# EAGLE schematic Esquemático_Grupo_6 (EAGLE 9.6.2)
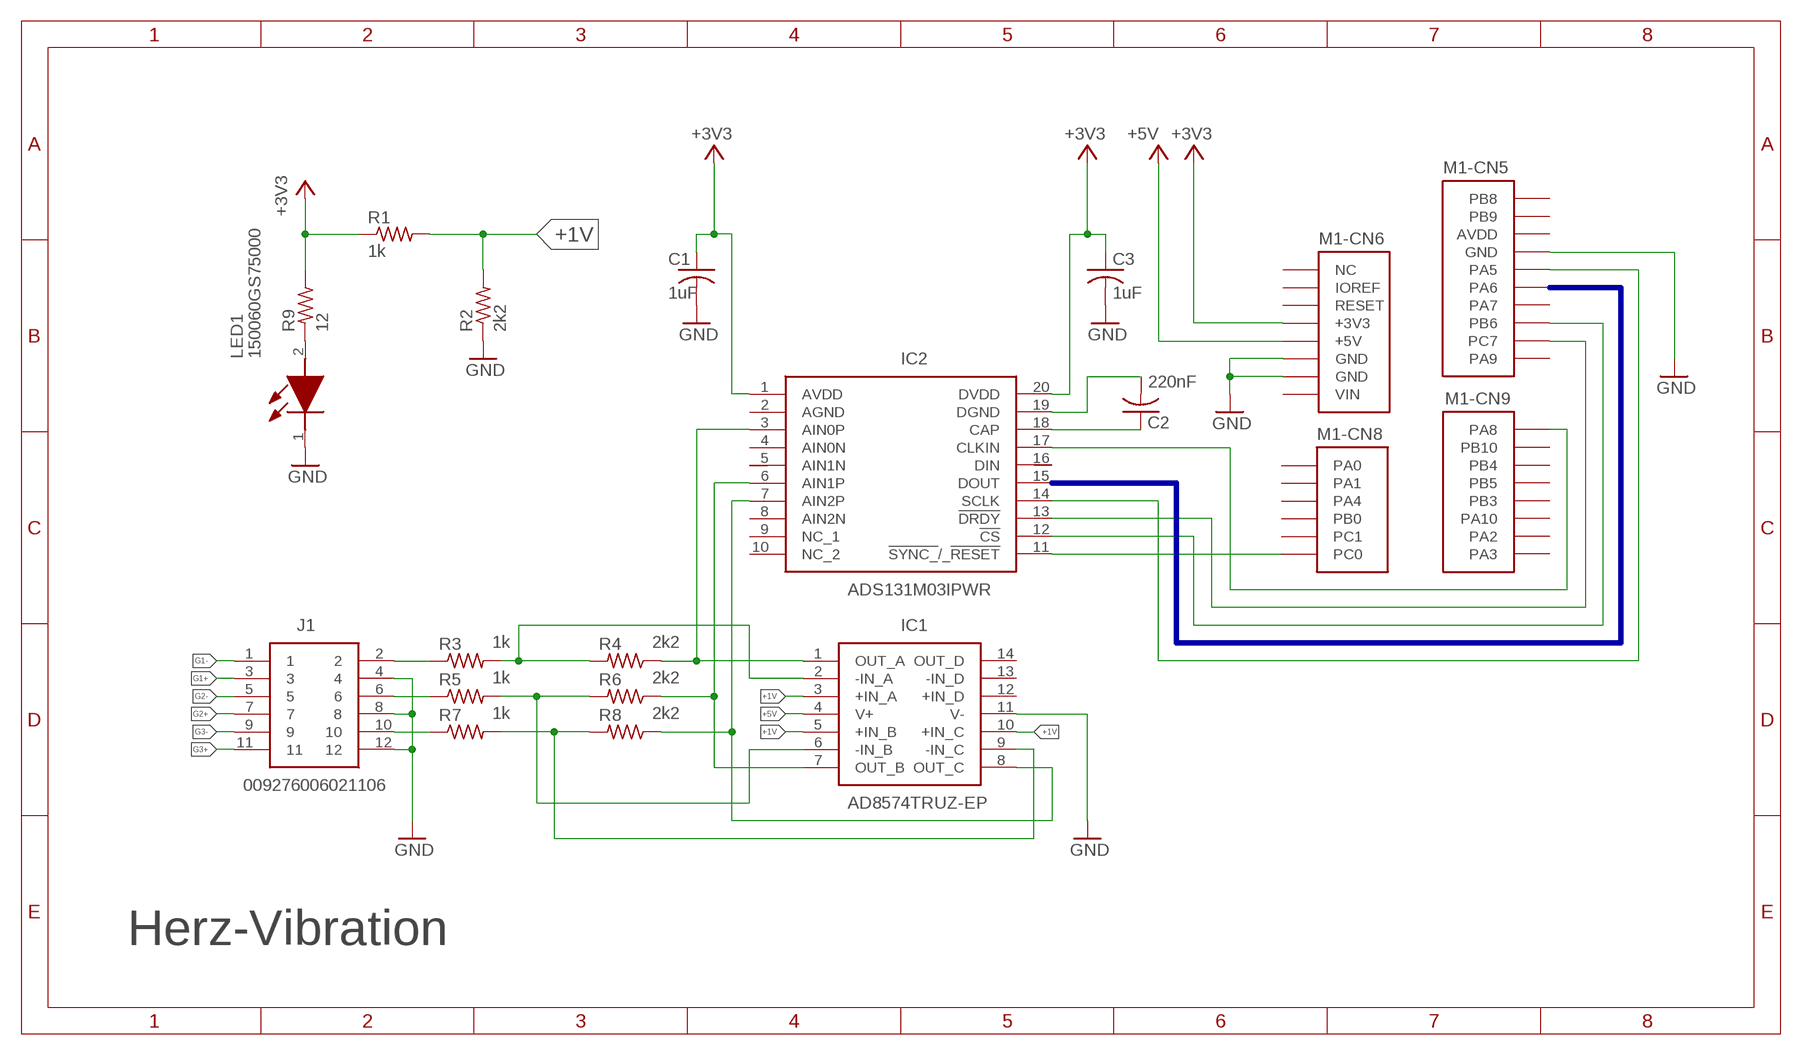
[diagram p0: schematic, sheet 1]

## Parts
C1  1uF  C-USC0805  [C0805]
C2  220nF  C-USC0805  [C0805]
C3  1uF  C-USC0805  [C0805]
IC1  AD8574TRUZ-EP  [SOP65P640X120-14N]
IC2  ADS131M03IPWR  [SOP65P640X120-20N]
J1  009276006021106  [009276006021106]
LED1  150060GS75000  [LEDC1608X80N]
M1  NUCLEO-L452RE  [NUCLEO-64]
R1  1k  R-US_R0805  [R0805]
R2  2k2  R-US_R0805  [R0805]
R3  1k  R-US_R0805  [R0805]
R4  2k2  R-US_R0805  [R0805]
R5  1k  R-US_R0805  [R0805]
R6  2k2  R-US_R0805  [R0805]
R7  1k  R-US_R0805  [R0805]
R8  2k2  R-US_R0805  [R0805]
R9  12  R-US_R0805  [R0805]
U$1  NC_MARKER  (no package)
U$2  NC_MARKER  (no package)
U$3  NC_MARKER  (no package)
U$4  NC_MARKER  (no package)
U$5  NC_MARKER  (no package)
U$6  NC_MARKER  (no package)
U$7  NC_MARKER  (no package)
U$8  NC_MARKER  (no package)
U$9  NC_MARKER  (no package)
U$10  NC_MARKER  (no package)
U$11  NC_MARKER  (no package)
U$12  NC_MARKER  (no package)
U$13  NC_MARKER  (no package)
U$14  NC_MARKER  (no package)
U$15  NC_MARKER  (no package)
U$16  NC_MARKER  (no package)
U$17  NC_MARKER  (no package)
U$18  NC_MARKER  (no package)
U$19  NC_MARKER  (no package)
U$20  NC_MARKER  (no package)
U$21  NC_MARKER  (no package)
U$22  NC_MARKER  (no package)
U$23  NC_MARKER  (no package)
U$24  NC_MARKER  (no package)
U$25  NC_MARKER  (no package)
U$26  NC_MARKER  (no package)
U$27  NC_MARKER  (no package)
U$28  NC_MARKER  (no package)
U$29  NC_MARKER  (no package)
U$30  NC_MARKER  (no package)

## Nets
+1V: IC1.3(+IN_A) IC1.5(+IN_B) IC1.10(+IN_C) R1.2 R2.2
+3V3: C1.1 C3.1 IC2.1(AVDD) IC2.20(DVDD) M1.CN6-4(-CN6:+3V3) R1.1 R9.1
+5V: IC1.4(V+) M1.CN6-5(-CN6:+5V)
G1+: J1.3
G1-: J1.1
G2+: J1.7
G2-: J1.5
G3+: J1.11
G3-: J1.9
GND: C1.2 C3.2 IC1.11(V-) J1.4 J1.8 J1.12 LED1.1(K) M1.CN5-7(-CN5:GND) M1.CN6-6(-CN6:GND) M1.CN6-7(-CN6:GND) R2.1
N$1: IC1.1(OUT_A) IC2.3(AIN0P) R4.1
N$2: IC1.7(OUT_B) IC2.6(AIN1P) R6.1
N$3: IC1.8(OUT_C) IC2.7(AIN2P) R8.1
N$4: IC1.2(-IN_A) R3.2 R4.2
N$5: M1.CN6-2(-CN6:IOREF) U$13.P$1
N$6: IC1.9(-IN_C) R7.2 R8.2
N$7: IC1.6(-IN_B) R5.2 R6.2
N$8: M1.CN6-8(-CN6:VIN) U$14.P$1
N$9: M1.CN5-8(-CN5:AVDD) U$15.P$1
N$10: J1.2 R3.1
N$11: IC2.14(SCLK) M1.CN5-6(-CN5:PA5)
N$12: J1.6 R5.1
N$13: IC2.4(AIN0N) U$16.P$1
N$14: J1.10 R7.1
N$15: IC2.13(!DRDY) M1.CN5-2(-CN5:PC7)
N$16: IC2.12(!CS) M1.CN5-3(-CN5:PB6)
N$17: LED1.2(A) R9.2
N$18: M1.CN6-3(-CN6:RESET) U$7.P$1
N$19: IC1.14(OUT_D) U$8.P$1
N$20: IC1.13(-IN_D) U$9.P$1
N$21: IC1.12(+IN_D) U$10.P$1
N$22: IC2.9(NC_1) U$11.P$1
N$23: IC2.10(NC_2) U$12.P$1
N$24: IC2.5(AIN1N) U$17.P$1
N$25: IC2.8(AIN2N) U$18.P$1
N$26: C2.1 IC2.18(CAP)
N$27: IC2.17(CLKIN) M1.CN9-8(-CN9:PA8)
N$28: IC2.16(DIN) U$19.P$1
N$29: C2.2 IC2.19(DGND)
N$30: IC2.2(AGND) U$20.P$1
N$31: IC2.11(!SYNC_!/_!RESET) M1.CN8-6(-CN8:PC0)
N$32: M1.CN9-7(-CN9:PB10) U$6.P$1
N$33: M1.CN9-6(-CN9:PB4) U$21.P$1
N$34: M1.CN9-5(-CN9:PB5) U$22.P$1
N$35: M1.CN9-4(-CN9:PB3) U$23.P$1
N$36: M1.CN9-3(-CN9:PA10) U$24.P$1
N$37: M1.CN9-2(-CN9:PA2) U$25.P$1
N$38: M1.CN9-1(-CN9:PA3) U$26.P$1
N$39: M1.CN5-1(-CN5:PA9) U$27.P$1
N$40: M1.CN5-4(-CN5:PA7) U$28.P$1
N$41: M1.CN5-10(-CN5:PB8) U$29.P$1
N$42: M1.CN5-9(-CN5:PB9) U$30.P$1
Unconnected: IC2.15(DOUT) M1.CN5-5(-CN5:PA6) M1.CN6-1(-CN6:NC) M1.CN7-1(-CN7:PC10) M1.CN7-2(-CN7:PC11) M1.CN7-3(-CN7:PC12) M1.CN7-4(-CN7:PD2) M1.CN7-6(-CN7:E5V) M1.CN7-7(-CN7:BOOT0) M1.CN7-9(-CN7:NC) M1.CN7-10(-CN7:NC) M1.CN7-11(-CN7:NC) M1.CN7-12(-CN7:IOREF) M1.CN7-13(-CN7:PA13) M1.CN7-14(-CN7:RESET) M1.CN7-15(-CN7:PA14) M1.CN7-17(-CN7:PA15) M1.CN7-21(-CN7:PB7) M1.CN7-23(-CN7:PC13) M1.CN7-25(-CN7:PC14) M1.CN7-26(-CN7:NC) M1.CN7-27(-CN7:PC15) M1.CN7-28(-CN7:PA0) M1.CN7-29(-CN7:PH0) M1.CN7-30(-CN7:PA1) M1.CN7-31(-CN7:PH1) M1.CN7-32(-CN7:PA4) M1.CN7-34(-CN7:PB0) M1.CN7-35(-CN7:PC2) M1.CN7-36(-CN7:PC1) M1.CN7-37(-CN7:PC3) M1.CN7-38(-CN7:PC0) M1.CN8-1(-CN8:PA0) M1.CN8-2(-CN8:PA1) M1.CN8-3(-CN8:PA4) M1.CN8-4(-CN8:PB0) M1.CN8-5(-CN8:PC1) M1.CN10-1(-CN10:PC9) M1.CN10-2(-CN10:PC8) M1.CN10-3(-CN10:PB8) M1.CN10-4(-CN10:PC6) M1.CN10-5(-CN10:PB9) M1.CN10-6(-CN10:PC5) M1.CN10-10(-CN10:NC) M1.CN10-11(-CN10:PA5) M1.CN10-12(-CN10:PA12) M1.CN10-13(-CN10:PA6) M1.CN10-14(-CN10:PA11) M1.CN10-15(-CN10:PA7) M1.CN10-16(-CN10:PB12) M1.CN10-17(-CN10:PB6) M1.CN10-18(-CN10:PB11) M1.CN10-19(-CN10:PC7) M1.CN10-21(-CN10:PA9) M1.CN10-22(-CN10:PB2) M1.CN10-23(-CN10:PA8) M1.CN10-24(-CN10:PB1) M1.CN10-25(-CN10:PB10) M1.CN10-26(-CN10:PB15) M1.CN10-27(-CN10:PB4) M1.CN10-28(-CN10:PB14) M1.CN10-29(-CN10:PB5) M1.CN10-30(-CN10:PB13) M1.CN10-31(-CN10:PB3) M1.CN10-33(-CN10:PA10) M1.CN10-34(-CN10:PC4) M1.CN10-35(-CN10:PA2) M1.CN10-36(-CN10:NC) M1.CN10-37(-CN10:PA3) M1.CN10-38(-CN10:NC) U$1.P$1 U$2.P$1 U$3.P$1 U$4.P$1 U$5.P$1

## Buses
SPI:CLK,CS,MISO,MOSI

## Notes on the sheet
- Herz-Vibration

## Power pins joined to a net without a drawn wire
+3V3: M1.CN7-16(-CN7:+3V3)
+5V: M1.CN7-18(-CN7:+5V)
AGND: M1.CN10-32(-CN10:AGND)
AVDD: M1.CN10-7(-CN10:AVDD)
GND: M1.CN7-8(-CN7:GND) M1.CN7-19(-CN7:GND) M1.CN7-20(-CN7:GND) M1.CN7-22(-CN7:GND) M1.CN10-9(-CN10:GND) M1.CN10-20(-CN10:GND)
U5V: M1.CN10-8(-CN10:U5V)
VBAT: M1.CN7-33(-CN7:VBAT)
VDD: M1.CN7-5(-CN7:VDD)
VIN: M1.CN7-24(-CN7:VIN)

## Library data of the parts
C1-C3 = rcl:C-US: CAPACITOR, American symbol; SPICEPREFIX: C
IC1 = SamacSys_Parts:AD8574TRUZ-EP: Amplificateurs oprationnels - Amplis-Op QUAD PRECISION RAIL RAIL CHOPPER OP AMP Source: Datasheet <https://componentsearchengine.com/Datasheets/1/AD8574TRUZ-EP.pdf>; ARROW_PART_NUMBER: AD8574TRUZ-EP; ARROW_PRICE-STOCK: https://www.arrow.com/en/products/ad8574truz-ep/analog-devices?region=nac; DESCRIPTION: Amplificateurs oprationnels - Amplis-Op QUAD PRECISION RAIL RAIL CHOPPER OP AMP; HEIGHT: 1.2mm; MANUFACTURER_NAME: Analog Devices; MANUFACTURER_PART_NUMBER: AD8574TRUZ-EP; MOUSER_PART_NUMBER: 584-AD8574TRUZ-EP; MOUSER_PRICE-STOCK: https://www.mouser.co.uk/ProductDetail/Analog-Devices/AD8574TRUZ-EP?qs=wUXugUrL1qxNfkZ2pBeSrA%3D%3D
IC2 = SamacSys_Parts:ADS131M03IPWR: Analog to Digital Converters - ADC 24-bit, 32-kSPS, 3-channel, simultaneous-sampling, delta-sigma ADC Source: Datasheet <https://www.ti.com/lit/ds/symlink/ads131m03.pdf?ts=1627392539825&ref_url=https%3A%2F%2Fwww.ti.com%2Fproduct%2FADS131M03%3FkeyMatch%3DADS131M03IPWR%26tisearch%3Dsearch-everything%26usecase%3DOPN>; DESCRIPTION: Analog to Digital Converters - ADC 24-bit, 32-kSPS, 3-channel, simultaneous-sampling, delta-sigma ADC; HEIGHT: 1.2mm; MANUFACTURER_NAME: Texas Instruments; MANUFACTURER_PART_NUMBER: ADS131M03IPWR; MOUSER_PART_NUMBER: 595-ADS131M03IPWR; MOUSER_PRICE-STOCK: https://www.mouser.co.uk/ProductDetail/Texas-Instruments/ADS131M03IPWR?qs=Jslch3jnSjnSosXolUzTvg%3D%3D
J1 = SamacSys_Parts:009276006021106: AVX INTERCONNECT - 009276006021106 - CONNECTOR, IDC, 6 WAY, 18 AWG Source: Datasheet <https://componentsearchengine.com/Datasheets/2/009276006021106.pdf>; ARROW_PART_NUMBER: 009276006021106; ARROW_PRICE-STOCK: https://www.arrow.com/en/products/009276006021106/avx?region=nac; DESCRIPTION: AVX INTERCONNECT - 009276006021106 - CONNECTOR, IDC, 6 WAY, 18 AWG; HEIGHT: 5mm; MANUFACTURER_NAME: AVX; MANUFACTURER_PART_NUMBER: 009276006021106; MOUSER_PART_NUMBER: 581-009276006021106; MOUSER_PRICE-STOCK: https://www.mouser.co.uk/ProductDetail/AVX/009276006021106?qs=QtI0yD1FyOMc2fy6i4jFlw%3D%3D
LED1 = SamacSys_Parts:150060GS75000: Wurth Elektronik WL-SMCW 520 nm Green LED, 1608 (0603) Clear SMD package Source: Datasheet <https://componentsearchengine.com/Datasheets/2/150060GS75000.pdf>; DESCRIPTION: Wurth Elektronik WL-SMCW 520 nm Green LED, 1608 (0603) Clear SMD package; HEIGHT: 0.8mm; MANUFACTURER_NAME: Wurth Elektronik; MANUFACTURER_PART_NUMBER: 150060GS75000; MOUSER_PART_NUMBER: 710-150060GS75000; MOUSER_PRICE-STOCK: https://www.mouser.co.uk/ProductDetail/Wurth-Elektronik/150060GS75000?qs=LlUlMxKIyB0UYkq5lDO8nA%3D%3D
M1 = NUCLEO-L452RE:NUCLEO-L452RE: No existe un outline (Layer Dimension) para esta librería. En su lugar se utilizó una referencia en tDocu. Al momento de diseñar la tarjeta, el Dimension debe ser dibujado según los requerimientos del usuario, o simplemente copiar los contenidos del tDocu en Dimensions.
R1-R9 = rcl:R-US_: RESISTOR, American symbol; SPICEPREFIX: R
U$1-U$30 = NC_MARKER:NC_MARKER